# Altium schematic sheet ChangeLog.SchDoc: ChangeLog
size A4; DocumentNumber: 7; SheetNumber: 7; SheetTotal: 8
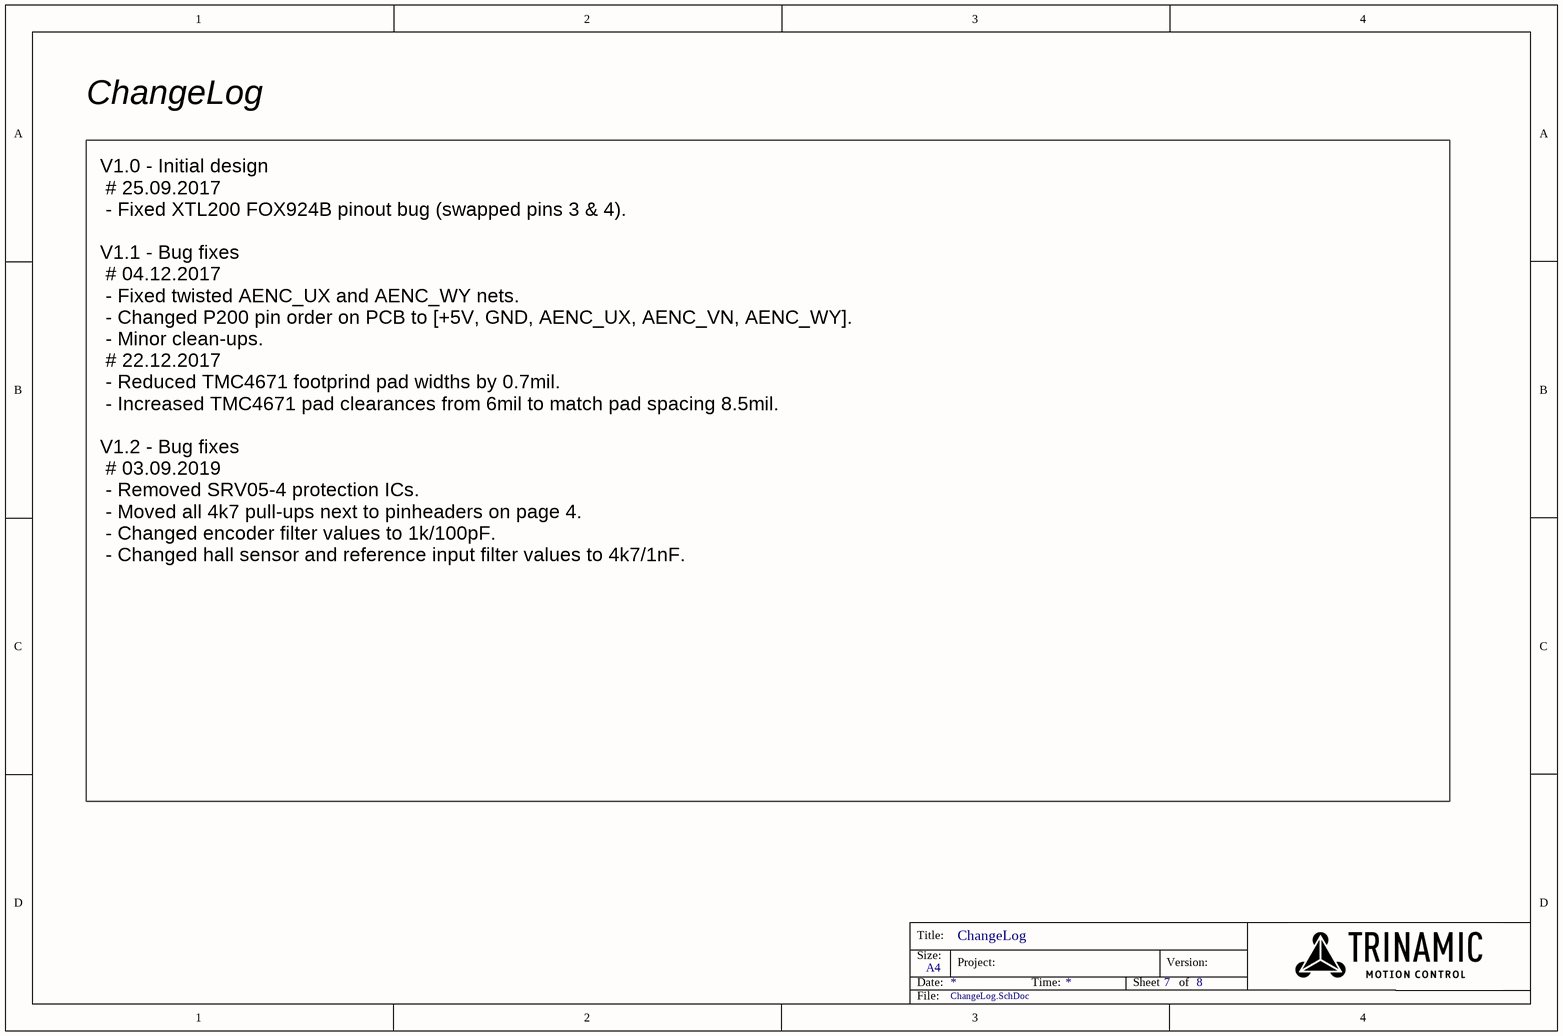
[diagram p0: ChangeLog.SchDoc]

## Notes on the sheet
- ChangeLog
- V1.0 - Initial design
  # 25.09.2017
  - Fixed XTL200 FOX924B pinout bug (swapped pins 3 & 4).
  V1.1 - Bug fixes
  # 04.12.2017
  - Fixed twisted AENC_UX and AENC_WY nets.
  - Changed P200 pin order on PCB to [+5V, GND, AENC_UX, AENC_VN, AENC_WY].
  - Minor clean-ups.
  # 22.12.2017
  - Reduced TMC4671 footprind pad widths by 0.7mil.
  - Increased TMC4671 pad clearances from 6mil to match pad spacing 8.5mil.
  V1.2 - Bug fixes
  # 03.09.2019
  - Removed SRV05-4 protection ICs.
  - Moved all 4k7 pull-ups next to pinheaders on page 4.
  - Changed encoder filter values to 1k/100pF.
  - Changed hall sensor and reference input filter values to 4k7/1nF.
- Title:
- Size:
- Date:
- A4
- Project:
- Time:
- Sheet
- Version:
- of
- File: